# EAGLE design riffle-thpr-v0.1 (EAGLE 7.2.0)
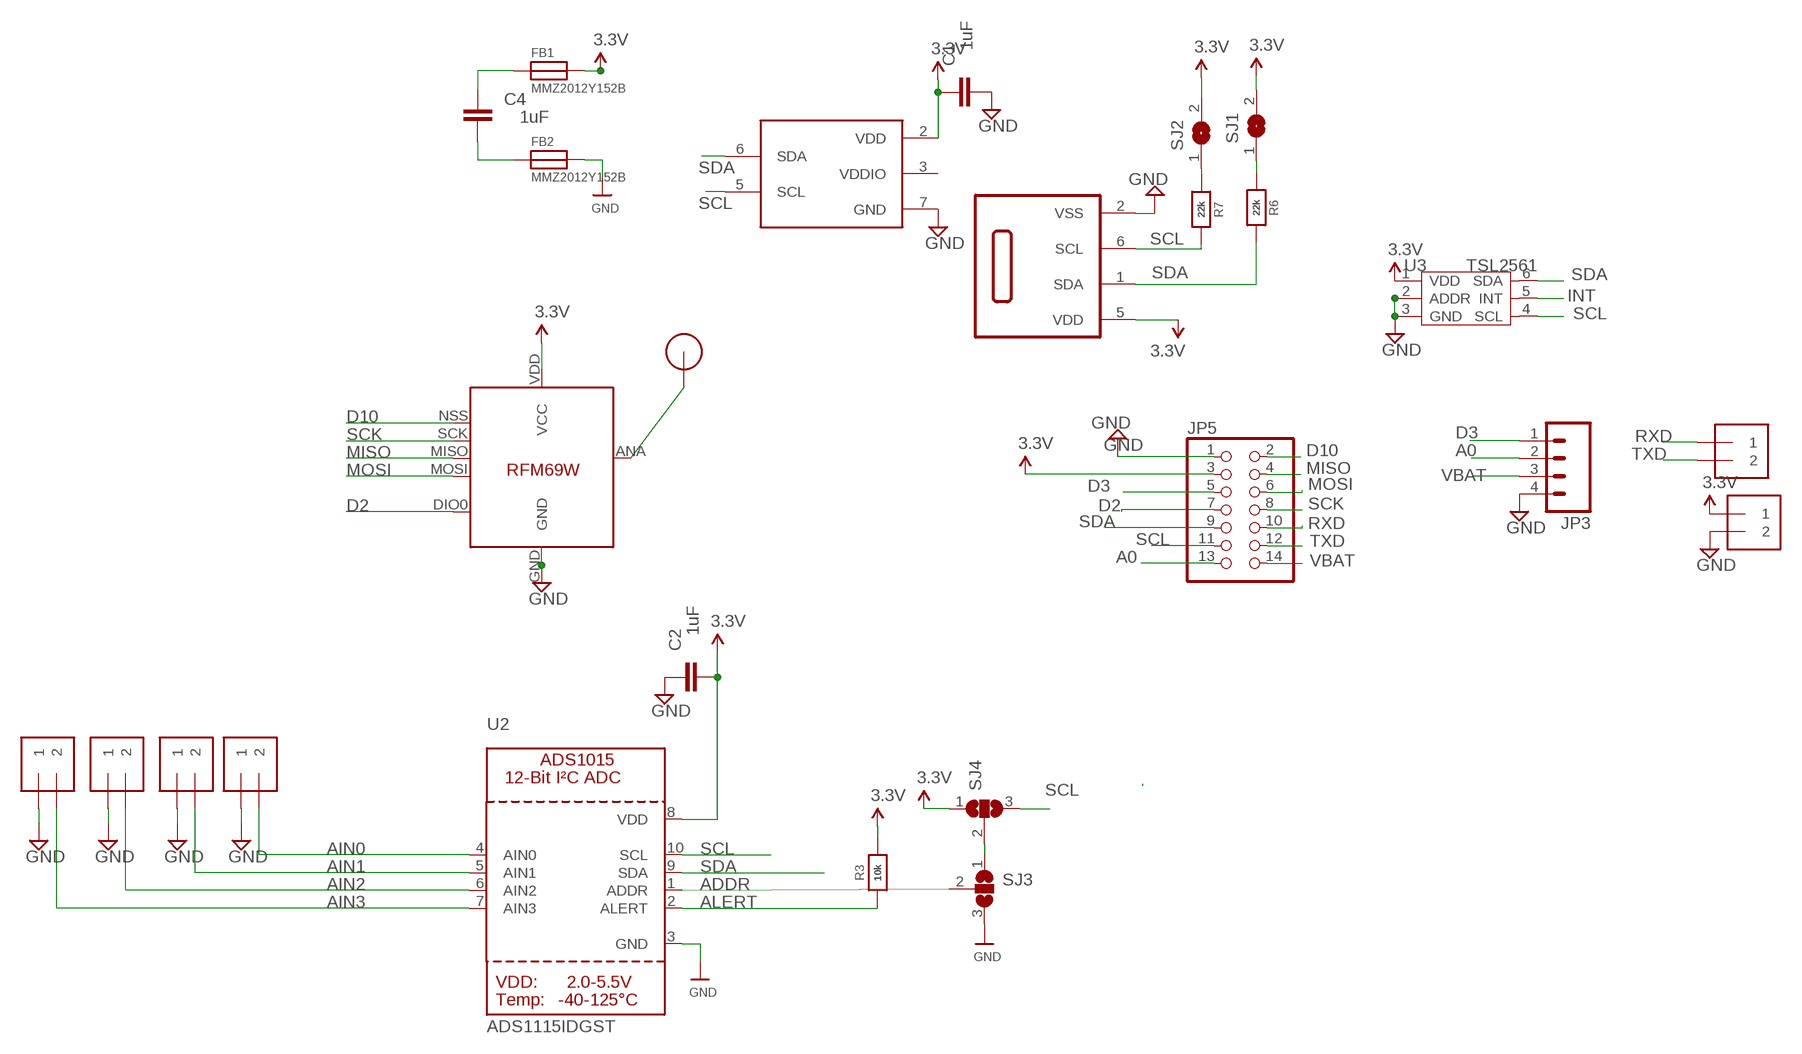
[diagram p0: schematic, sheet 1]

## Parts
C1  1uF  CAP0603-CAP  [0603-CAP]
C2  1uF  CAP0603-CAP  [0603-CAP]
C4  1uF  CAP0603-CAP  [0603-CAP]
FB1  MMZ2012Y152B  FERRITE0805  [0805]
FB2  MMZ2012Y152B  FERRITE0805  [0805]
IN0  1X2-3.5MM  [1X2-3.5MM]
IN1  1X2-3.5MM  [1X2-3.5MM]
IN2  1X2-3.5MM  [1X2-3.5MM]
IN3  1X2-3.5MM  [1X2-3.5MM]
IN4  1X2-3.5MM  [1X2-3.5MM]
IN5  1X2-3.5MM  [1X2-3.5MM]
JP3  M04SMD  [1X04-SMD]
JP5  PINHD-2X7  [2X07]
R3  10k  RESISTOR_0603_NOOUT  [0603-NO]
R6  22k  RESISTOR_0603_NOOUT  [0603-NO]
R7  22k  RESISTOR_0603_NOOUT  [0603-NO]
SJ1  SJ  [SJ]
SJ2  SJ  [SJ]
SJ3  SJ2W  [SJ_2]
SJ4  SJ2W  [SJ_2]
SN1  SHT21  [DFN6/SHT]
U1  BMP180  [BMP180]
U2  ADS1115IDGST  ADC_ADS1015  [MSOP10]
U3  TSL2561  TSL2561T  [TMB-6]
U$1  RFM12B_ANTENNA  [RFM12B-ANTENNA]
U$5  RFM69  [RFM69W-MINPADS]

## Nets
A0: JP3.2 JP5.13
ADDR: SJ3.2 U2.1(ADDR)
AIN0: IN0.2 U2.4(AIN0)
AIN1: IN1.2 U2.5(AIN1)
AIN2: IN2.2 U2.6(AIN2)
AIN3: IN3.2 U2.7(AIN3)
ALERT: R3.1 U2.2(ALERT)
D2: JP5.7 U$5.DIO0
D3: JP3.1 JP5.5
D10: JP5.2 U$5.NSS(SEL)
GND: C1.1 C2.2 FB2.2 IN0.1 IN1.1 IN2.1 IN3.1 IN5.2 JP3.4 JP5.1 SJ3.3 SN1.2(VSS) U1.7(GND) U2.3(GND) U3.2(ADDR) U3.3(GND) U$5.GND
INT: U3.5(INT)
MISO: JP5.4 U$5.MISO
MOSI: JP5.6 U$5.MOSI
N$1: C4.2 FB1.1
N$2: C4.1 FB2.1
N$3: SJ3.1 SJ4.2
N$5: R6.1 SJ1.1
N$6: R7.1 SJ2.1
N$23: U$1.P$1 U$5.ANA(ANT)
RXD: IN4.1 JP5.10
SCK: JP5.8 U$5.SCK
SCL: JP5.11 R7.2 SJ4.3 SN1.6(SCL) U1.5(SCL) U2.10(SCL) U3.4(SCL)
SDA: JP5.9 R6.2 SN1.1(SDA) U1.6(SDA) U2.9(SDA) U3.6(SDA)
TXD: IN4.2 JP5.12
VBAT [vcc]: JP3.3 JP5.14
VCC: C1.2 C2.1 FB1.2 IN5.1 JP5.3 R3.2 SJ1.2 SJ2.2 SJ4.1 SN1.5(VDD) U1.2(VDD) U2.8(VDD) U3.1(VDD) U$5.VDD(VCC) ; supply symbol labelled 3.3V

## Power pins joined to a net without a drawn wire
VDDIO: U1.3(VDDIO)

## Library data of the parts
C1 C2 C4 = SparkFun:CAP: Capacitor Standard 0603 ceramic capacitor, and 0.1" leaded capacitor.
FB1 FB2 = microbuilder:FERRITE: Ferrite Bead 0603 MMZ1608B121C - 120 Ohm, 600mA Ferrite Chip - Digikey: 445-2164-1-ND BK1608HW121-T - 120 Ohm, 600mA Ferrite Chip - Digikey: 587-1876-2-ND 0805 HZ0805B272R-10 - 2.7K Ohm @ 100MHz, 200mA 0.8 Ohm DC Resistance - Digikey: 240-2504-1-ND (see also Murata BLM21BD272SN1L)
IN0 IN1-IN5 = adafruit:1X2: 3.5mm Terminal block http://www.ladyada.net/library/pcb/eaglelibrary.html
JP3 = SparkFun:M04: Header 4 Standard 4-pin 0.1" header. Use with straight break away headers (SKU : PRT-00116), right angle break away headers (PRT-00553), swiss pins (PRT-00743), machine pins (PRT-00117), and female headers (PRT-00115). Molex polarized connector foot print use with SKU : PRT-08231 with associated crimp pins and housings.
JP5 = pinhead:PINHD-2X7: PIN HEADER
R3 R6 R7 = microbuilder:RESISTOR: Resistors For new designs, use the packages preceded by an '_' character since they are more reliable: The following footprints should be used on most boards: _0402 - Standard footprint for regular board layouts _0603 - Standard footprint for regular board layouts _0805 - Standard footprint for regular board layouts _1206 - Standard footprint for regular board layouts For extremely tight-pitch boards where space is at a premium, the following 'micro-pitch' footprints can be used (smaller pads, no silkscreen outline, etc.): _0402MP - Micro-pitch footprint for very dense/compact boards _0603MP - Micro-pitch footprint for very dense/compact boards _0805MP - Micro-pitch footprint for very dense/compact boards _1206MP - Micro-pitch footprint for very dense/compact boards
SJ1 SJ2 = jumper:SJ: SMD solder JUMPER
SJ3 SJ4 = jumper:SJ2W: SMD solder JUMPER
SN1 = SHT21:SHT21
U1 = BMP180:BMP180
U2 = microbuilder:ADC_ADS1015: ADS1015 - 12-bit 4-Channel I2C ADC with Internal PGA VDD: 2.0-5.5V Sampling Rate: 3.3ksps Gain Settings: 2/3, 1, 2, 4, 8, 16 I2C Address: ADDR low = 1001000x, ADDR high = 1001001x Internal Comparator The ADS1015 includes an internal comparator that can be set to output a high-level on ALERT when the conversion results exceeeds a pre-defined upper level, and will deassert itself when the level falls below a pre-defined lower threshold level. It can also be set to windowed mode where the ALERT pin will be asserted if the data exceeds the upper threshold or falls below the lower threshold.
U3 = template:TSL2561: Light-TO-Digital Converter
U$1 = LowPowerLab:RFM12B_ANTENNA
U$5 = LowPowerLab:RFM69

## Board
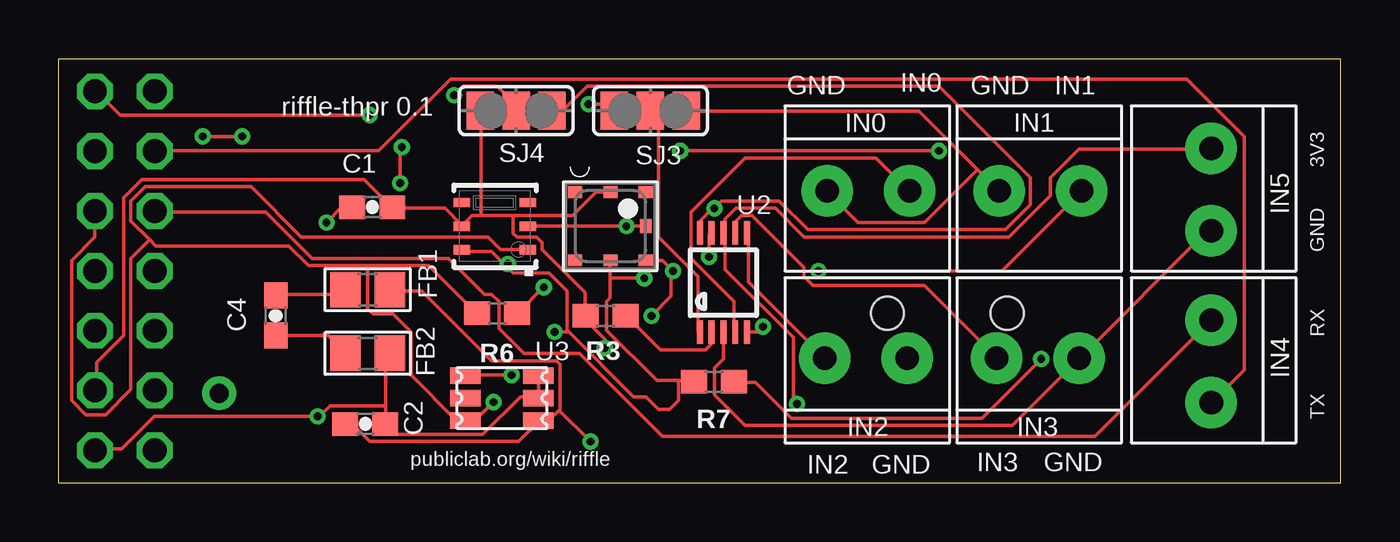
[diagram p1: board, top side]
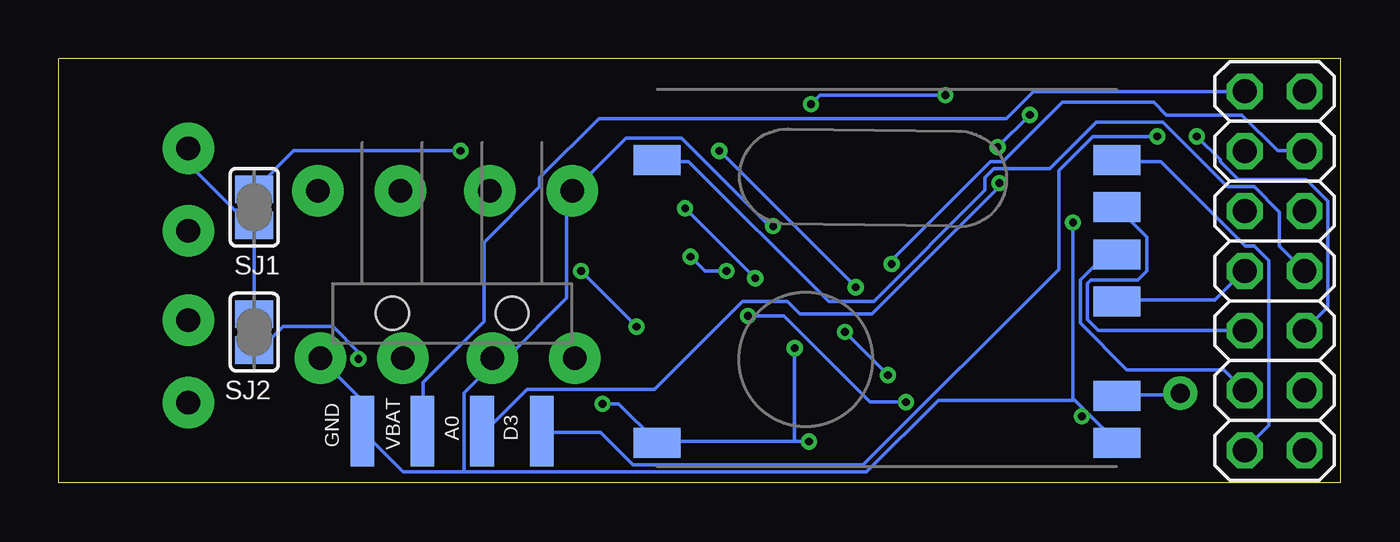
[diagram p2: board, bottom side, seen from below]

Size 54.39 x 18 mm. Coordinates in mm from the lower left corner, seen from the top.
Outline: 0,0 0,18 54.39,18 54.39,0 0,0
Copper layers (1*16): Top 0.0356mm / dielectric 1.5011mm / Bottom 0.0356mm
Design rules "LaenPCBOrder": minimum track width 6mil, minimum drill 13mil, track to track 6mil, track to pad 6mil, pad to pad 6mil, via to via 6mil, smd to smd 6mil, copper to edge 15mil, drill to drill 6mil, minimum pad ring 7mil, minimum via ring 7mil, stop-mask expansion 3mil, vias tented up to drill 0mil, thermal gap 10mil

### Footprints (pad centres in the part's own frame; a part is rotated, then mirrored left to right if it is on the bottom)
0603-CAP = smd 1.1 x 1: 1 -0.85,0; 2 0.85,0
0805 = smd 1.3 x 1.5: 1 -0.95,0; 2 0.95,0
1X2-3.5MM = drill 1 pad 2.184: 1 1.8,0; 2 -1.7,0
1X04-SMD = smd 1 x 3: 1 -3.81,5; 2 -1.27,5; 3 1.27,5; 4 3.81,5 | hole 1.4: -2.54,0; 2.54,0
2X07 = drill 1.016 octagon: 1 -7.62,-1.27; 2 -7.62,1.27; 3 -5.08,-1.27; 4 -5.08,1.27; 5 -2.54,-1.27; 6 -2.54,1.27; 7 0,-1.27; 8 0,1.27; 9 2.54,-1.27; 10 2.54,1.27; 11 5.08,-1.27; 12 5.08,1.27; 13 7.62,-1.27; 14 7.62,1.27
0603-NO = smd 1.1 x 1: 1 -0.85,0; 2 0.85,0
SJ = smd 1.168 x 1.6: 1 -0.762,0; 2 0.762,0
SJ_2 = smd 1.168 x 1.6: 1 -1.524,0; 2 0,0; 3 1.524,0
DFN6/SHT = smd 0.4 x 0.7: 1 -1,-1.4; 2 0,-1.4; 3 1,-1.4; 4 1,1.4; 5 0,1.4; 6 -1,1.4
BMP180 = smd 0.6 x 0.5: 1 1.5,1.45; 2 0,1.45; 3 -1.5,1.45; 4 -1.5,-1.45; 5 0,-1.45; 6 1.5,-1.45 | smd 0.5 x 0.6: 7 1.5,0
MSOP10 = smd 0.25 x 1: 1 -1,-2.113; 2 -0.5,-2.113; 3 0,-2.113; 4 0.5,-2.113; 5 1,-2.113; 6 1,2.113; 7 0.5,2.113; 8 0,2.113; 9 -0.5,2.113; 10 -1,2.113
TMB-6 = smd 1.3 x 0.7: 1 -1.55,0.95; 2 -1.55,0; 3 -1.55,-0.95; 4 1.55,-0.95; 5 1.55,0; 6 1.55,0.95
RFM12B-ANTENNA = drill 0.8 pad 1.422: P$1 0,0
RFM69W-MINPADS = smd 2 x 1.27: ANA 8,-5; DIO0 -11.5,5; GND 8,-7; MISO 8,1; MOSI 8,3; NSS 8,5; SCK 8,-1; VDD -11.5,-7

### Placement (x,y rotation side)
C1  13.3,11.7 0 top
C2  13,2.5 0 top
C4  9.2,7.1 90 top
FB1  13.1,8.2 0 top
FB2  13.1,5.5 0 top
IN0  34.4,12.4 180 top
IN1  41.7,12.4 180 top
IN2  34.2,5.3 0 top
IN3  41.5,5.3 0 top
IN4  48.9,5.1 90 top
IN5  48.9,12.4 90 top
JP3  37.7,7.2 180 bottom
JP5  2.8,9 90 bottom
R3  23.2,7.1 180 top
R6  18.6,7.2 180 top
R7  27.8,4.3 180 top
SJ1  46.1,11.7 270 bottom
SJ2  46.1,6.4 90 bottom
SJ3  25.1,15.8 0 top
SJ4  19.4,15.8 0 top
SN1  18.5,10.9 90 top
U1  23.4,10.9 0 top
U2  28.2,8.5 0 top
U3  18.8,3.6 180 top
U$1  6.8,3.8 0 top
U$5  17.5,8.7 0 bottom

### Tracks (layer width: path | path; a pad name or v marks a point on that pad's centre or on a via)
A0  (via drill 0.33)
  Top 0.152: v14.48,12.72 14.48,14.17 v14.55,14.25 | v13.18,15.62 2.59,15.62 1.6,16.61 JP5.13
  Bottom 0.152: v14.48,12.72 14.48,12.57 19.89,7.16 22.94,7.16 23.47,7.7 25.38,7.7 29.11,3.96 34.52,3.96 36.27,2.21 JP3.2 | v13.18,15.62 v14.55,14.25
ADDR
  Top 0.152: U2.1 27.13,6.4 27.13,8.76 25.45,10.44 25.45,15.47 25.15,15.77 SJ3.2
AIN0
  Top 0.152: U2.4 28.65,6.4 28.65,7.7 26.82,9.53 26.82,11.51 29.11,13.79 34.67,13.79 36.04,12.42 IN0.2
AIN1  (via drill 0.33)
  Top 0.152: v29.87,6.63 29.64,6.4 29.26,6.4 U2.5 | v32.23,8.99 40.01,8.99 43.36,12.34 IN1.2
  Bottom 0.152: v32.23,8.99 v29.87,6.63
AIN2
  Top 0.152: U2.6 29.26,10.59 29.26,8.53 32.46,5.33 IN2.2
AIN3
  Top 0.152: U2.7 28.73,10.67 28.73,11.12 28.96,11.35 29.41,11.35 31.62,9.14 31.62,8.76 32,8.38 36.73,8.38 39.78,5.33 IN3.2
ALERT
  Top 0.152: U2.2 27.66,6.33 27.66,5.87 27.43,5.64 25.53,5.64 24.08,7.09 R3.1
D2
  Bottom 0.152: U$5.DIO0 28.96,13.64 27.66,13.64 21.72,7.7 19.81,7.7 15.09,12.42 15.09,12.95 14.71,13.34 12.34,13.34 10.36,15.32 7.54,15.32 4.8,12.57 3.66,12.57 2.59,11.51 2.59,10.06 1.6,9.07 JP5.7
D3  (via drill 0.33)
  Top 0.152: v6.1,14.71 v7.77,14.71
  Bottom 0.152: v7.77,14.71 10.52,14.71 11.96,13.26 11.96,9.07 20.27,0.76 30.02,0.76 31.39,2.13 33.83,2.13 JP3.1 | v6.1,14.71 5.11,13.72 5.11,13.64 4.34,12.88 1.45,12.88 0.53,11.96 0.53,7.47 1.52,6.48 JP5.5
D10
  Bottom 0.152: U$5.NSS 9.45,13.64 7.62,13.64 4.04,10.06 3.66,10.06 3.05,9.45 3.05,2.44 4.04,1.45 JP5.2
GND  (via drill 0.33)
  Top 0.152: 38.98,13.3 39.85,12.42 IN1.1 | 38.98,13.3 36.5,15.77 26.67,15.77 SJ3.3 | U1.7 24.84,10.9 v24.08,10.9 19.96,10.9 SN1.2 | 38.98,13.3 36.73,11.05 33.91,11.05 32.61,12.34 IN0.1 | v11.35,11.05 11.96,11.66 12.42,11.66 C1.1 | U3.3 20.34,4.5 20.34,3.66 U3.2 20.27,3.66 19.58,3.66 17.98,2.06 14.4,2.06 13.95,2.52 C2.2 13.87,2.52 13.87,3.28 | 13.87,3.28 13.87,5.33 14.02,5.49 FB2.2 | 13.87,3.28 11.51,3.28 11.05,2.82 v10.97,2.82 4.04,2.82 2.67,1.45 1.6,1.45 JP5.1 | U2.3 28.19,6.33 28.19,5.26 27.81,4.88 27.81,3.73 29.11,2.44 40.46,2.44 43.28,5.26 IN3.1 43.36,5.33 48.69,10.67 48.84,10.67 IN5.2
  Bottom 0.152: v24.08,10.9 24.23,10.9 27.96,14.63 30.33,14.63 32.54,12.42 IN0.1 32.61,12.34 32.84,12.12 32.84,7.85 35.36,5.33 35.97,5.33 IN2.1 36.04,5.26 36.04,4.95 37.19,3.81 37.19,0.46 | v11.35,11.05 11.35,3.58 11.32,3.54 | 10.78,3.01 9.53,1.75 U$5.GND | 10.78,3.01 11.32,3.54 | v10.97,2.82 10.78,3.01 | IN3.1 43.28,5.26 41.53,3.5 41.53,2.21 JP3.4 41.45,2.13 39.78,0.46 37.19,0.46 | 37.19,0.46 20.12,0.46 17.07,3.5 11.35,3.5 11.32,3.54
MISO
  Bottom 0.152: U$5.MISO 9.53,9.68 9.98,9.68 11.05,8.61 11.05,6.78 9.07,4.8 4.95,4.8 4.12,3.96 JP5.4
MOSI
  Bottom 0.152: U$5.MOSI 9.45,11.66 8.23,10.44 8.23,8.99 8.61,8.61 10.59,8.61 10.74,8.46 10.74,6.93 10.29,6.48 4.12,6.48 JP5.6
N$1
  Top 0.152: C4.2 9.22,8 11.96,8 12.12,8.15 FB1.1
N$2
  Top 0.152: C4.1 9.22,6.25 11.43,6.25 12.12,5.56 FB2.1
N$3  (via drill 0.33)
  Top 0.152: v16.76,16.46 17.14,16.84 18.59,16.84 19.36,16.08 19.36,15.85 SJ4.2 | v22.48,16.08 23.32,16.08 23.55,15.85 SJ3.1
  Bottom 0.152: v16.76,16.46 22.1,16.46 v22.48,16.08
N$5  (via drill 0.33)
  Top 0.152: v20.57,8.31 19.51,7.24 R6.1 | v37.34,14.1 v26.36,14.1
  Bottom 0.152: v26.36,14.1 v20.57,8.31 | v37.34,14.1 44.42,14.1 46.02,12.5 SJ1.1
N$6  (via drill 0.33)
  Top 0.152: v41.68,5.26 39.17,2.74 31.09,2.74 29.57,4.27 28.65,4.27 R7.1
  Bottom 0.152: v41.68,5.26 41.68,5.56 42.75,6.63 44.88,6.63 45.87,5.64 46.02,5.64 SJ2.1
N$23
  Bottom 0.152: U$5.ANA 9.45,3.73 6.86,3.73 U$1.P$1
RXD
  Top 0.152: JP5.10 4.12,11.51 8.76,11.51 10.74,9.53 16.54,9.53 18.06,8 18.36,8 18.67,7.7 18.67,6.55 19.74,5.49 22.1,5.49 25.6,1.98 43.97,1.98 48.84,6.86 IN4.1
SCK
  Bottom 0.152: U$5.SCK 9.45,7.77 5.33,7.77 4.12,8.99 JP5.8
SCL  (via drill 0.33)
  Top 0.152: 23.39,8.69 23.39,7.85 23.24,7.7 23.24,6.48 25.38,4.34 26.29,4.34 | 23.39,8.69 U1.5 | 26.29,4.34 26.9,4.34 R7.2 | 18.94,9.26 19.28,8.91 20.8,8.91 21.57,8.15 21.57,6.48 21.6,6.44 | 18.94,9.26 18.36,9.83 17.14,9.83 SN1.6 | 21.6,6.44 24.38,3.66 24.92,3.66 25.45,3.12 25.91,3.12 26.29,3.5 26.29,4.34 | 23.39,8.69 v24.84,8.69 | U2.10 27.2,10.67 27.2,11.12 27.74,11.66 v27.81,11.66 28.12,11.96 30.56,11.96 31.77,10.74 40.16,10.74 41.22,11.81 41.22,12.95 37.34,16.84 22.4,16.84 21.41,15.85 20.95,15.85 SJ4.3 | v19.2,4.57 17.3,4.57 U3.4 | v21.03,6.4 21.57,6.4 21.6,6.44 | v19.05,9.3 18.97,9.3 18.94,9.26
  Bottom 0.152: v24.84,8.69 v27.81,11.66 | v21.03,6.4 v19.2,4.57 | v19.05,9.3 19.05,9.45 14.86,13.64 14.33,13.64 11.81,16.15 7.92,16.15 7.39,15.62 4.19,15.62 2.67,14.1 1.6,14.1 JP5.11
SDA  (via drill 0.33)
  Top 0.152: v27.58,9.6 27.58,10.52 27.66,10.59 U2.9 | U1.6 24.92,9.45 25.6,9.45 v26.06,8.99 25.98,8.99 25.98,7.92 v25.15,7.09 | 3.85,10.32 4.12,10.06 9.75,10.06 10.59,9.22 13.11,9.22 | 3.85,10.32 3.05,11.12 3.05,11.96 3.66,12.57 8.15,12.57 10.29,10.44 18.21,10.44 18.75,9.91 19.89,9.91 SN1.1 | 13.11,9.22 15.7,9.22 17.68,7.24 R6.2 | 13.11,9.22 13.11,7.39 13.34,7.16 14.17,7.16 14.94,6.4 14.94,4.57 16.84,2.67 17.22,2.67 U3.6 17.3,2.67 17.68,2.67 v18.44,3.43 | 3.85,10.32 3.05,9.53 3.05,3.96 1.98,2.9 1.14,2.9 0.53,3.5 0.53,9.45 1.52,10.44 1.52,11.51 JP5.9
  Bottom 0.152: v26.06,8.99 26.98,8.99 v27.58,9.6 | v25.15,7.09 23.62,7.09 19.96,3.43 v18.44,3.43
TXD
  Top 0.152: JP5.12 4.12,14.1 13.56,14.1 16.61,17.14 47.85,17.14 50.29,14.71 50.29,4.8 48.92,3.43 IN4.2
VBAT
  Bottom 0.152: JP3.3 38.94,2.21 38.94,4.27 36.35,6.86 36.35,10.21 33.98,12.57 33.98,12.95 31.47,15.47 14.17,15.47 13.03,16.61 4.12,16.61 JP5.14
VCC  (via drill 0.33)
  Top 0.152: IN5.1 48.84,14.17 43.28,14.17 42.06,12.95 42.06,12.19 40.31,10.44 31.62,10.44 30.4,11.66 28.73,11.66 28.27,11.2 28.27,10.67 U2.8 28.27,10.59 28.27,9.07 31.17,6.17 31.17,3.5 v31.32,3.35 | C2.1 12.19,2.44 12.5,2.44 13.18,1.75 19.51,1.75 20.34,2.59 U3.1 20.42,2.67 20.8,2.67 21.22,3.09 | 21.22,3.09 21.26,3.12 21.26,5.03 21.11,5.18 18.36,5.18 15.39,8.15 14.1,8.15 FB1.2 | 21.22,3.09 v22.55,1.75 | 17.91,11.35 17.53,11.35 17.14,10.97 SN1.5 17.07,10.97 16.38,11.66 14.17,11.66 C1.2 14.1,11.73 12.95,12.88 3.5,12.88 2.74,12.12 2.74,6.25 1.6,5.11 1.6,3.96 JP5.3 | 17.91,11.35 19.28,11.35 | 19.28,11.35 21.79,11.35 22.78,12.34 U1.2 | 19.28,11.35 19.28,10.59 19.43,10.44 20.27,10.44 20.5,10.21 20.5,9.91 22.33,8.08 22.33,7.16 R3.2 22.4,7.09 22.4,6.86 23.16,6.1 v23.16,5.71 | 17.91,11.35 17.91,15.77 SJ4.1
  Bottom 0.152: SJ2.2 46.1,10.9 SJ1.2 46.18,10.9 46.86,11.58 46.94,11.58 48.84,13.49 48.84,14.17 IN5.1 | v22.55,1.75 23.16,1.75 | 23.16,1.75 28.96,1.75 U$5.VDD 29.03,1.75 30.63,3.35 v31.32,3.35 | v23.16,5.71 23.16,1.75

### Text on the board
tPlace: GND | IN0 | GND | IN1 | riffle-thpr 0.1 | 3V3 | GND | RX | TX | publiclab.org/wiki/riffle | IN2 | GND | IN3 | GND
bPlace: GND | D3 | A0 | VBAT